# EAGLE design HV_schematic (EAGLE 9.6.2)
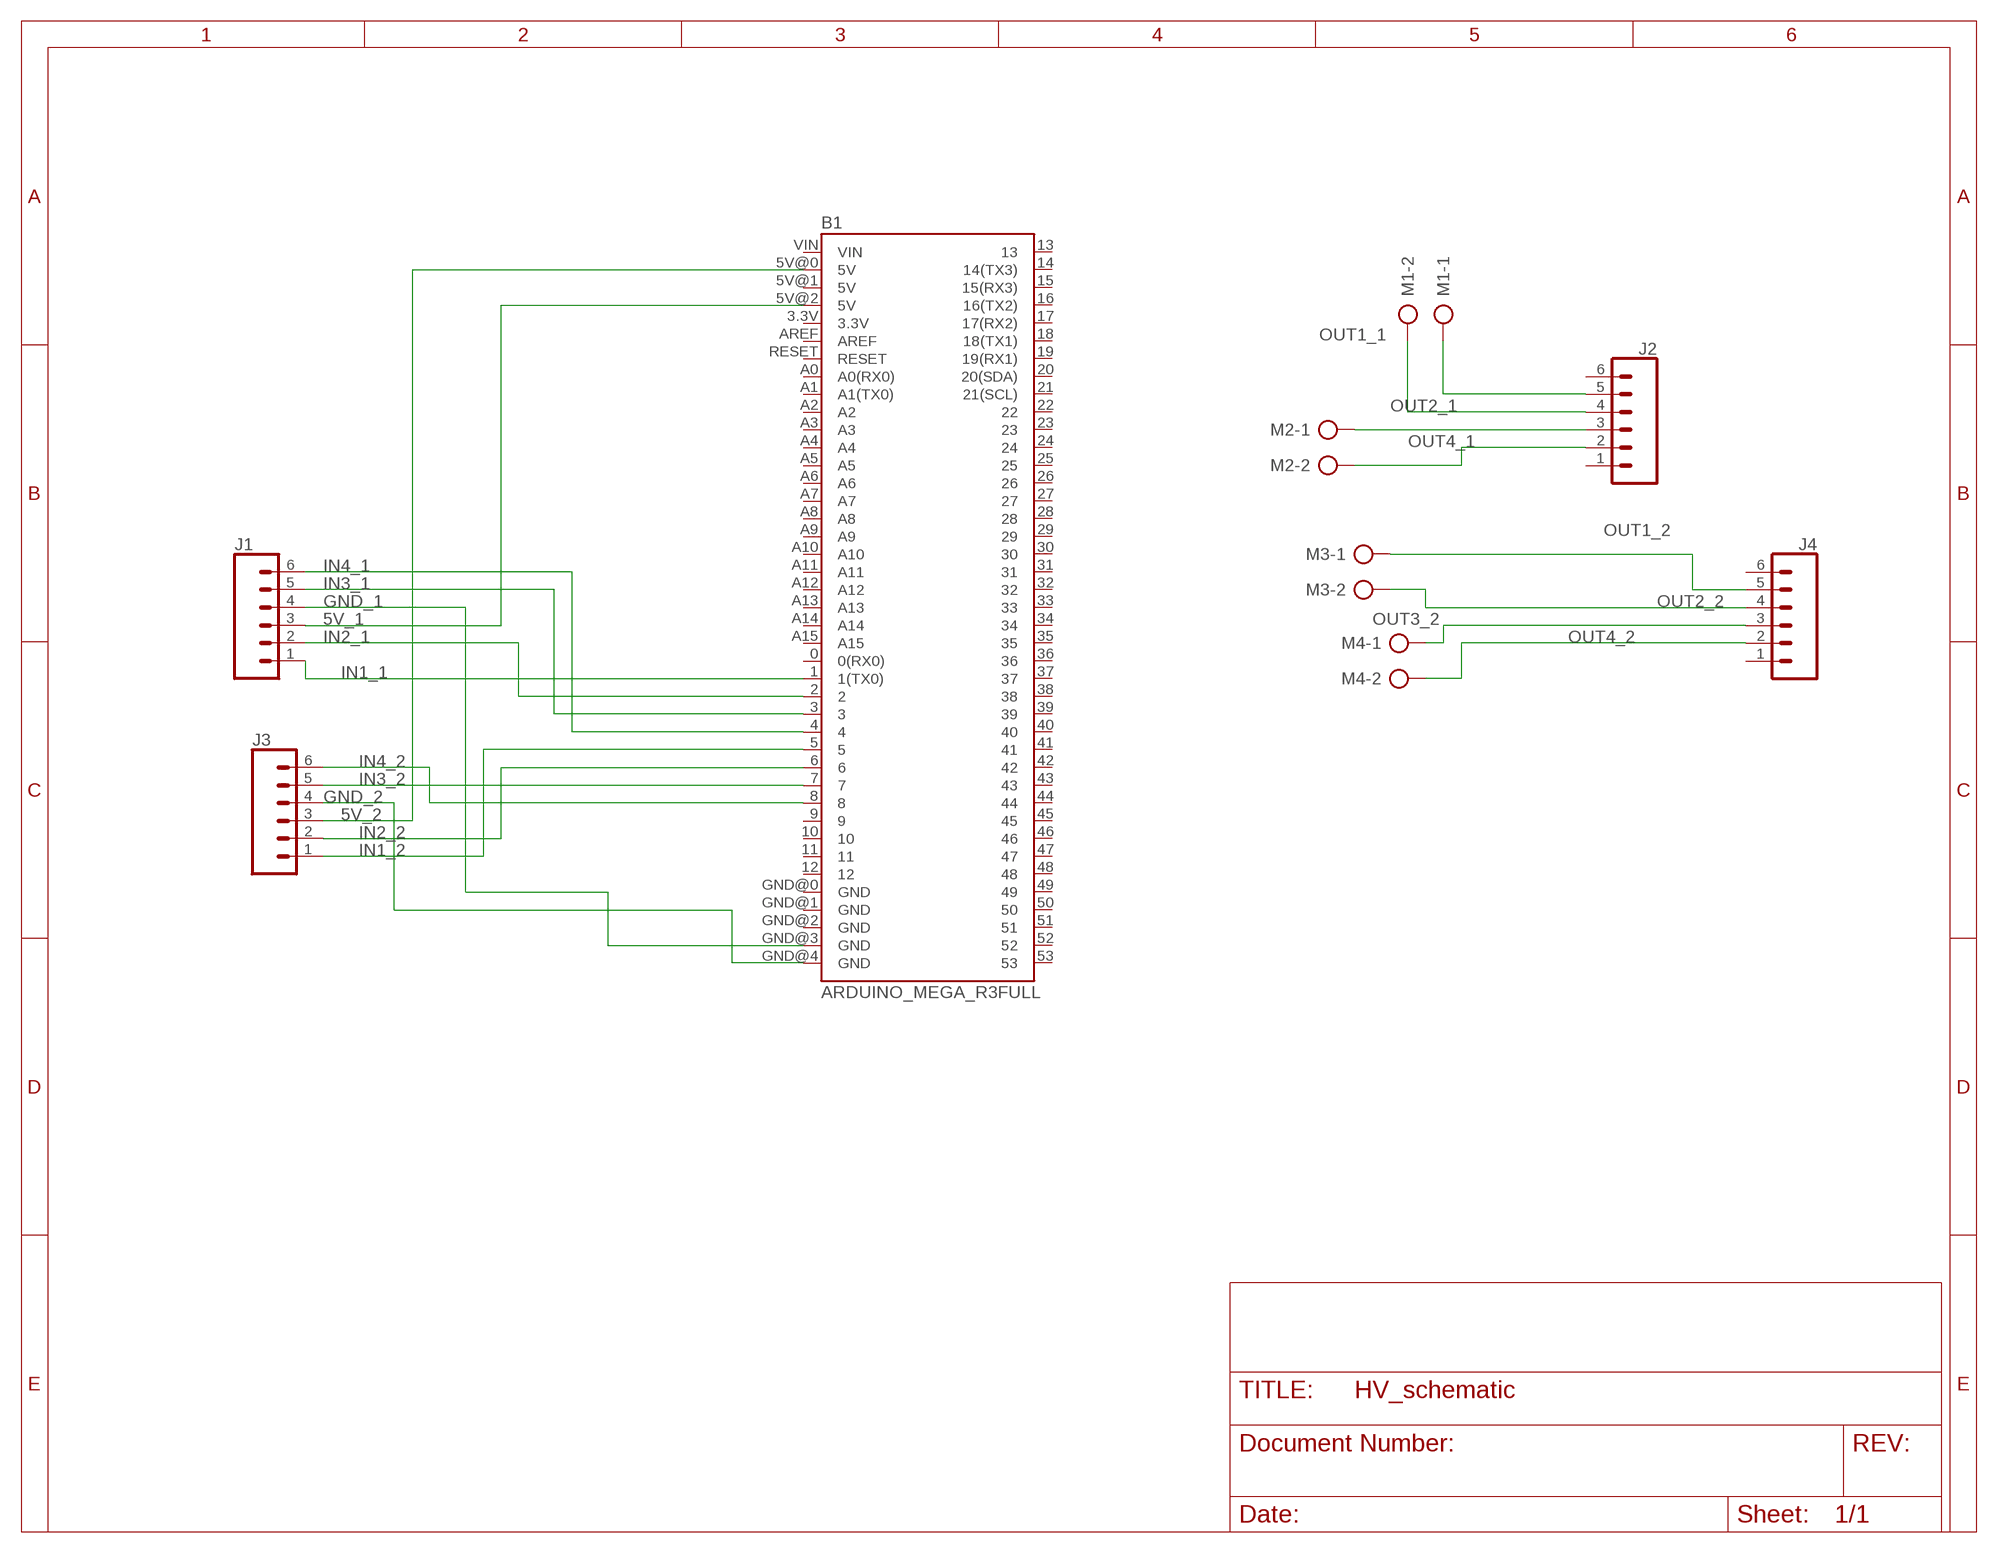
[diagram p0: schematic, sheet 1]

## Parts
B1  ARDUINO_MEGA_R3FULL  [ARDUINO_MEGA]
J1  CONN_06LONGPADS  [1X06_LONGPADS]
J2  CONN_06LONGPADS  [1X06_LONGPADS]
J3  CONN_06LONGPADS  [1X06_LONGPADS]
J4  CONN_06LONGPADS  [1X06_LONGPADS]
M1  AK500/2  [AK500/2]
M2  AK500/2  [AK500/2]
M3  AK500/2  [AK500/2]
M4  AK500/2  [AK500/2]

## Nets
5V_1: B1.5V@2(5V) J1.3
5V_2: B1.5V@0(5V) J3.3
GND_1: B1.GND@3(GND) J1.4
GND_2: B1.GND@4(GND) J3.4
IN1_1: B1.1(1(TX0)) J1.1
IN1_2: B1.5 J3.1
IN2_1: B1.2 J1.2
IN2_2: B1.6 J3.2
IN3_1: B1.3 J1.5
IN3_2: B1.7 J3.5
IN4_1: B1.4 J1.6
IN4_2: B1.8 J3.6
N$1: J2.3 M2.1
OUT1_1: J2.5 M1.1
OUT1_2: J4.5 M3.1
OUT2_1: J2.4 M1.2
OUT2_2: J4.4 M3.2
OUT3_2: J4.3 M4.1
OUT4_1: J2.2 M2.2
OUT4_2: J4.2 M4.2
Unconnected: B1.0(0(RX0)) B1.3.3V B1.5V@1(5V) B1.9 B1.10 B1.11 B1.12 B1.13 B1.14(14(TX3)) B1.15(15(RX3)) B1.16(16(TX2)) B1.17(17(RX2)) B1.18(18(TX1)) B1.19(19(RX1)) B1.20(20(SDA)) B1.21(21(SCL)) B1.22 B1.23 B1.24 B1.25 B1.26 B1.27 B1.28 B1.29 B1.30 B1.31 B1.32 B1.33 B1.34 B1.35 B1.36 B1.37 B1.38 B1.39 B1.40 B1.41 B1.42 B1.43 B1.44 B1.45 B1.46 B1.47 B1.48 B1.49 B1.50 B1.51 B1.52 B1.53 B1.A0(A0(RX0)) B1.A1(A1(TX0)) B1.A2 B1.A3 B1.A4 B1.A5 B1.A6 B1.A7 B1.A8 B1.A9 B1.A10 B1.A11 B1.A12 B1.A13 B1.A14 B1.A15 B1.AREF B1.GND@0(GND) B1.GND@1(GND) B1.GND@2(GND) B1.RESET B1.VIN J2.1 J2.6 J4.1 J4.6

## Library data of the parts
B1 = Will Library:ARDUINO_MEGA_R3: Arduino Mega R3 ATmega2560 R3 compatible footprint. SparkFun Products: Arduino Mega 2560 R3 <https://www.sparkfun.com/products/11061>
J1-J4 = SparkFun-Connectors:CONN_06: Multi connection point. Often used as Generic Header-pin footprint for 0.1 inch spaced/style header connections On any of the 0.1 inch spaced packages, you can populate with these: Break Away Headers - Straight <https://www.sparkfun.com/products/116> (PRT-00116) Break Away Male Headers - Right Angle <https://www.sparkfun.com/products/553> (PRT-00553) Female Headers <https://www.sparkfun.com/products/115> (PRT-00115) Break Away Headers - Machine Pin <https://www.sparkfun.com/products/117> (PRT-00117) Break Away Female Headers - Swiss Machine Pin <https://www.sparkfun.com/products/743> (PRT-00743) Arduino Stackable Header - 6 Pin <https://www.sparkfun.com/products/9280> (PRT-09280) For SCREWTERMINALS and SPRING TERMINALS visit here: Screw Terimnals on SparkFun.com <https://www.sparkfun.com/search/results?term=Screw+Terminals> (5mm/3.5mm/2.54mm spacing) This device is also useful as a general connection point to wire up your design to another part of your project. Our various solder wires solder well into these plated through hole pads. Hook-Up Wire - Assortment (Stranded, 22 AWG) <https://www.sparkfun.com/products/11375> (PRT-11375) Hook-Up Wire - Assortment (Solid Core, 22 AWG) <https://www.sparkfun.com/products/11367> (PRT-11367) View the entire wire category on our website here <https://www.sparkfun.com/categories/141>
M1-M4 = con-ptr500:AK500/2: CONNECTOR; OC_FARNELL: unknown; OC_NEWARK: unknown

## Board
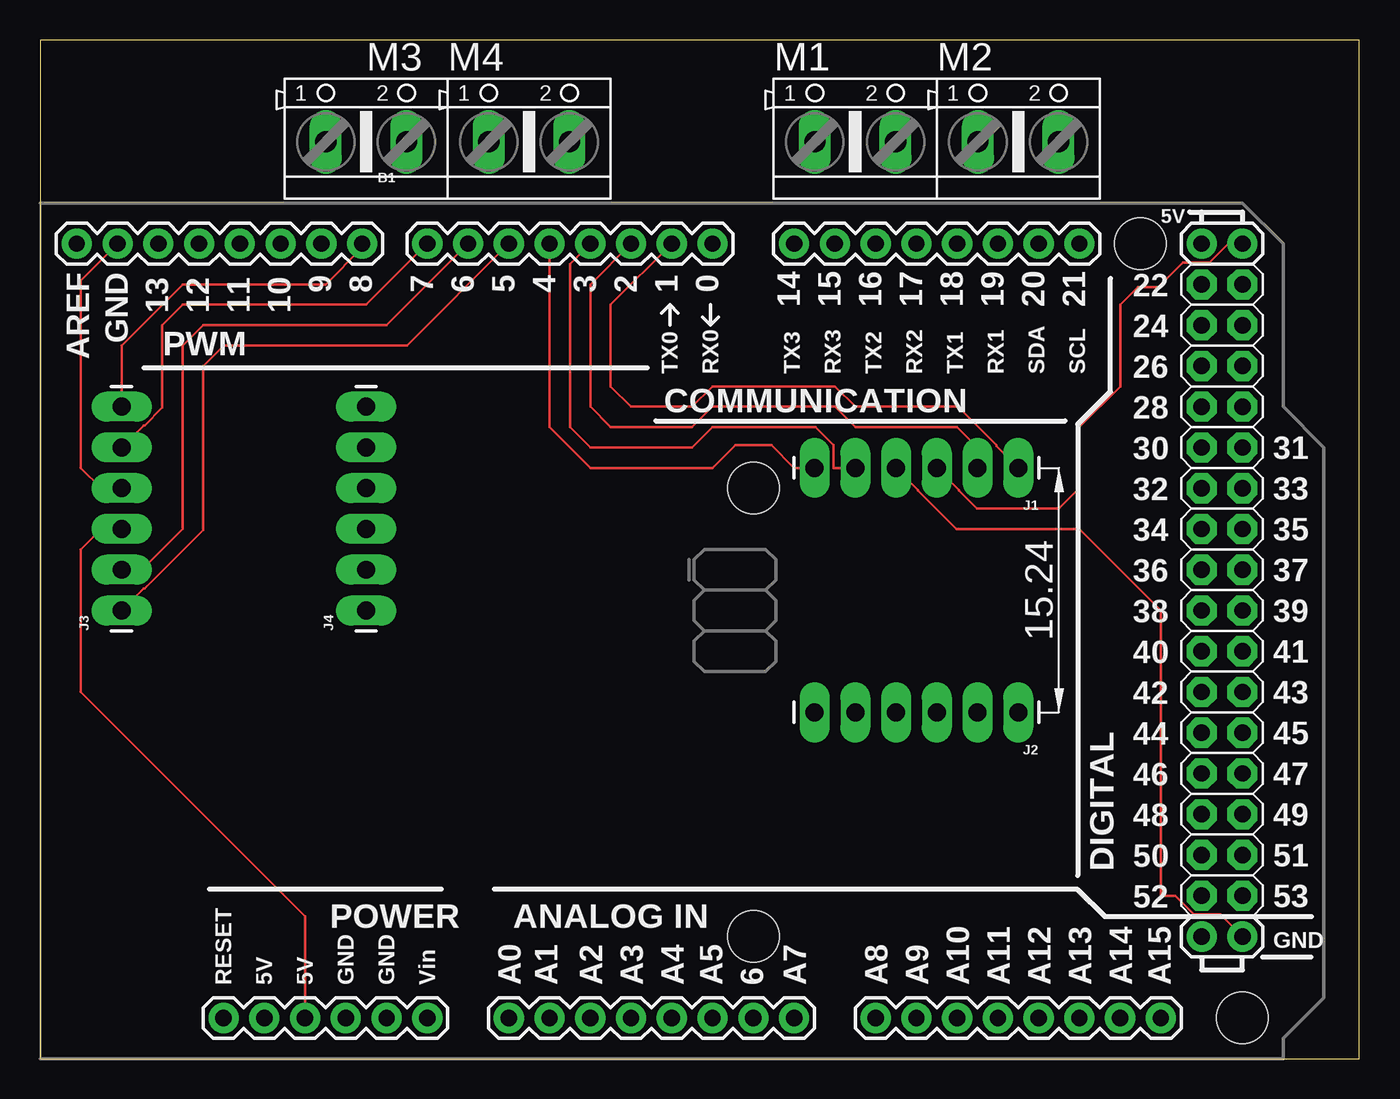
[diagram p1: board, top side]
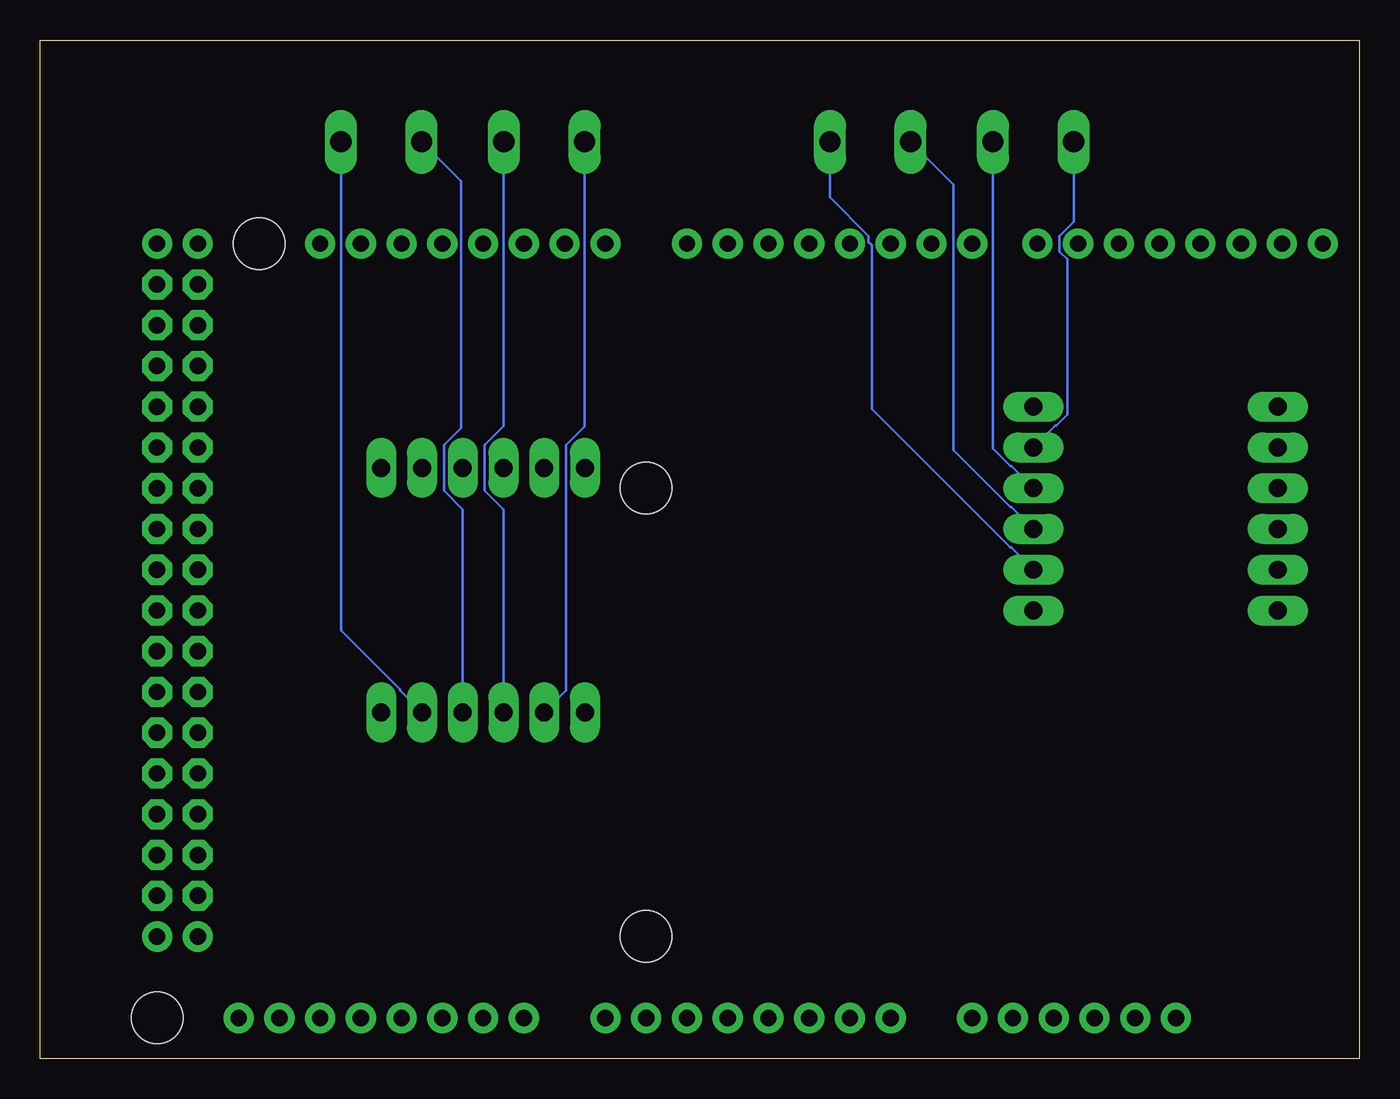
[diagram p2: board, bottom side, seen from below]

Size 82.22 x 63.49 mm. Coordinates in mm from the lower left corner, seen from the top.
Outline: 0,0 82.22,0 82.22,63.49 0,63.49 0,0
Copper layers (1*16): Top 0.035mm / dielectric 1.5mm / Bottom 0.035mm
Design rules "default": minimum track width 6mil, minimum drill 0.35mm, track to track 6mil, track to pad 6mil, pad to pad 6mil, via to via 6mil, smd to smd 6mil, copper to edge 40mil, drill to drill 6mil, minimum pad ring 10mil, minimum via ring 8mil, stop-mask expansion 4mil, vias tented up to drill 0mil, thermal gap 10mil

### Footprints (pad centres in the part's own frame; a part is rotated, then mirrored left to right if it is on the bottom)
ARDUINO_MEGA = drill 1.016 pad 1.88: 0 13.97,24.13; 1 11.43,24.13; 2 8.89,24.13; 3 6.35,24.13; 3.3V -13.97,-24.13; 4 3.81,24.13; 5 1.27,24.13; 5V@0 -11.43,-24.13; 5V@1 44.45,24.13; 5V@2 46.99,24.13; 6 -1.27,24.13; 7 -3.81,24.13; 8 -7.874,24.13; 9 -10.414,24.13; 10 -12.954,24.13; 11 -15.494,24.13; 12 -18.034,24.13; 13 -20.574,24.13; 14 19.05,24.13; 15 21.59,24.13; 16 24.13,24.13; 17 26.67,24.13; 18 29.21,24.13; 19 31.75,24.13; 20 34.29,24.13; 21 36.83,24.13; A0 1.27,-24.13; A1 3.81,-24.13; A2 6.35,-24.13; A3 8.89,-24.13; A4 11.43,-24.13; A5 13.97,-24.13; A6 16.51,-24.13; A7 19.05,-24.13; A8 24.13,-24.13; A9 26.67,-24.13; A10 29.21,-24.13; A11 31.75,-24.13; A12 34.29,-24.13; A13 36.83,-24.13; A14 39.37,-24.13; A15 41.91,-24.13; AREF -25.654,24.13; GND@0 -8.89,-24.13; GND@1 -6.35,-24.13; GND@2 44.45,-19.05; GND@3 46.99,-19.05; GND@4 -23.114,24.13; RESET -16.51,-24.13; VIN -3.81,-24.13 | drill 1.016 pad 1.88 octagon: 22 44.45,21.59; 23 46.99,21.59; 24 44.45,19.05; 25 46.99,19.05; 26 44.45,16.51; 27 46.99,16.51; 28 44.45,13.97; 29 46.99,13.97; 30 44.45,11.43; 31 46.99,11.43; 32 44.45,8.89; 33 46.99,8.89; 34 44.45,6.35; 35 46.99,6.35; 36 44.45,3.81; 37 46.99,3.81; 38 44.45,1.27; 39 46.99,1.27; 40 44.45,-1.27; 41 46.99,-1.27; 42 44.45,-3.81; 43 46.99,-3.81; 44 44.45,-6.35; 45 46.99,-6.35; 46 44.45,-8.89; 47 46.99,-8.89; 48 44.45,-11.43; 49 46.99,-11.43; 50 44.45,-13.97; 51 46.99,-13.97; 52 44.45,-16.51; 53 46.99,-16.51 | hole 3.2: 16.51,8.89; 16.51,-19.05; 40.64,24.13; 46.99,-24.13
1X06_LONGPADS = drill 1.118 pad 1.88 long: 1 0,0; 2 2.54,0; 3 5.08,0; 4 7.62,0; 5 10.16,0; 6 12.7,0
AK500/2 = drill 1.321 long: 1 -2.515,0; 2 2.515,0

### Placement (x,y rotation side)
B1  27.94,26.67 0 top
J1  60.96,36.83 180 top
J2  60.96,21.59 180 top
J3  5.08,27.94 90 top
J4  20.32,27.94 90 top
M1  50.8,57.15 0 top
M2  60.96,57.15 0 top
M3  20.32,57.15 0 top
M4  30.48,57.15 0 top

### Tracks (layer width: path | path; a pad name or v marks a point on that pad's centre or on a via)
5V_1
  Top 0.152: J1.3 57.25,35.46 57.25,35.41 58.37,34.29 63.5,34.29 64.77,35.56 64.77,39.37 67.31,41.91 67.31,46.99 68.43,48.11 69.69,48.11 71.22,49.63 72.87,49.63 74.04,50.8 B1.5V@2
5V_2
  Top 0.152: J3.3 3.81,33.02 2.54,31.75 2.54,22.86 16.51,8.89 B1.5V@0
GND_1
  Top 0.152: J1.4 54.71,35.46 54.71,35.41 57.1,33.02 64.77,33.02 69.85,27.94 69.85,10.16 70.74,10.16 71.91,8.99 73.56,8.99 B1.GND@3
GND_2
  Top 0.152: J3.4 3.81,35.56 2.54,36.83 2.54,48.51 B1.GND@4
IN1_1
  Top 0.152: B1.1 35.56,46.99 35.56,41.91 36.83,40.64 40.64,40.64 41.91,41.91 49.53,41.91 50.8,40.64 57.2,40.64 59.59,38.25 59.59,38.2 J1.1
IN1_2
  Top 0.152: J3.1 6.45,29.31 6.5,29.31 10.16,32.97 10.16,43.18 11.43,44.45 22.86,44.45 B1.5
IN2_1
  Top 0.152: B1.2 34.29,48.26 34.29,40.64 35.56,39.37 40.64,39.37 41.91,40.64 49.53,40.64 50.8,39.37 57.15,39.37 58.42,38.1 J1.2
IN2_2
  Top 0.152: B1.6 21.59,45.72 10.16,45.72 8.89,44.45 8.89,33.02 6.35,30.48 J3.2
IN3_1
  Top 0.152: J1.5 49.43,36.83 49.43,38.25 48.31,39.37 41.91,39.37 40.64,38.1 34.29,38.1 33.02,39.37 33.02,49.53 B1.3
IN3_2
  Top 0.152: J3.5 6.45,39.47 6.5,39.47 7.62,40.59 7.62,45.72 8.89,46.99 20.32,46.99 B1.7
IN4_1
  Top 0.152: B1.4 31.75,39.37 34.29,36.83 41.91,36.83 43.34,38.25 45.56,38.25 46.99,36.83 J1.6
IN4_2
  Top 0.152: J3.6 5.08,44.45 8.89,48.26 17.78,48.26 20.07,50.55 B1.8
N$1
  Bottom 0.152: J2.3 55.88,34.24 57.05,35.41 57.05,38.25 55.98,39.32 55.98,54.69 M2.1
OUT1_1
  Bottom 0.152: J2.5 49.43,22.96 49.43,38.25 48.28,39.4 M1.1
OUT1_2
  Bottom 0.152: J4.5 18.95,39.47 18.9,39.47 18.21,40.16 18.21,49.83 18.69,50.32 18.69,51.28 17.8,52.17 M3.1
OUT2_1
  Bottom 0.152: M1.2 53.34,57.12 53.34,39.42 54.51,38.25 54.51,35.41 53.34,34.24 J2.4
OUT2_2
  Bottom 0.152: J4.4 21.69,36.93 21.74,36.93 22.84,38.02 M3.2
OUT3_2
  Bottom 0.152: J4.3 21.69,34.39 21.74,34.39 25.3,37.95 25.3,54.48 M4.1
OUT4_1
  Bottom 0.152: J2.2 59.79,22.96 59.79,23.01 63.48,26.7 M2.2
OUT4_2
  Bottom 0.152: M4.2 32.99,53.7 30.58,51.28 30.58,50.9 30.38,50.7 30.38,40.49 21.74,31.85 21.69,31.85 J4.2